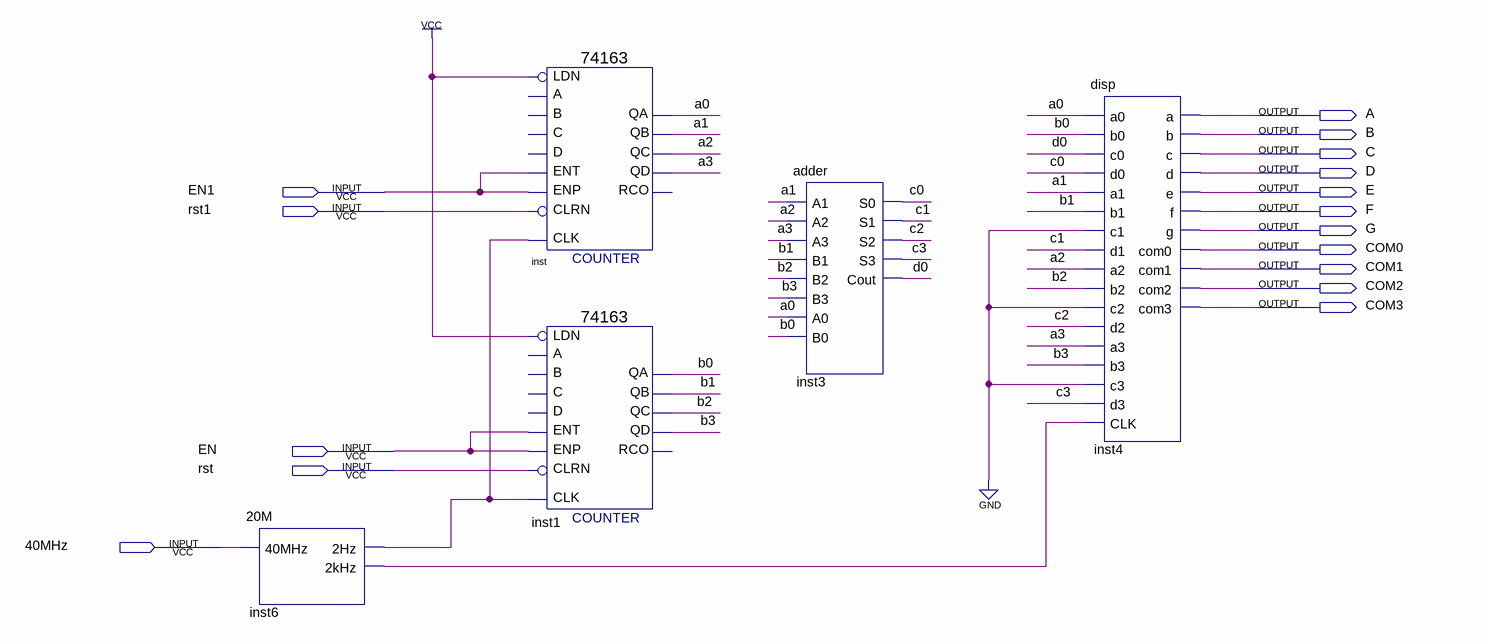
[diagram p0: schematic sheet]
// Quartus schematic A1.bdf as structural Verilog: 5 symbols, 16 pins
module A1 (
  input  EN1,
  input  rst1,
  input  EN,
  input  rst,
  input  \40MHz ,
  output A,
  output B,
  output C,
  output D,
  output E,
  output F,
  output G,
  output COM0,
  output COM1,
  output COM2,
  output COM3
);

  wire a0, a1, a2, a3, b0, b1, b2, b3, c0, c1, c2, c3, d0, inst6_2hz, inst6_2khz;

  \20M  inst6 (.\40MHz (\40MHz ), .\2Hz (inst6_2hz), .\2kHz (inst6_2khz));
  \74163  inst (
    .ENT(EN1), .CLRN(rst1), .CLK(inst6_2hz), .ENP(EN1), .LDN(1'b1), .QA(a0), .QB(a1), .QC(a2), .QD(a3));  // open: C, B, A, D, RCO
  \74163  inst1 (
    .ENT(EN), .CLRN(rst), .CLK(inst6_2hz), .ENP(EN), .LDN(1'b1), .QA(b0), .QB(b1), .QC(b2), .QD(b3));  // open: C, B, A, D, RCO
  adder inst3 (
    .A1(a1), .A2(a2), .A3(a3), .B1(b1), .B2(b2), .B3(b3), .A0(a0), .B0(b0), .S0(c0), .S1(c1), .S2(c2),
    .S3(c3), .Cout(d0));
  disp inst4 (
    .a0(a0), .b0(b0), .c0(d0), .d0(c0), .a1(a1), .b1(b1), .c1(1'b0), .d1(c1), .a2(a2), .b2(b2), .c2(1'b0),
    .d2(c2), .a3(a3), .b3(b3), .c3(1'b0), .d3(c3), .CLK(inst6_2khz), .a(A), .b(B), .c(C), .d(D), .e(E),
    .f(F), .g(G), .com0(COM0), .com1(COM1), .com2(COM2), .com3(COM3));
endmodule
